# EAGLE design SensadoCalibradoMaquinas_v2 (EAGLE 9.6.2)
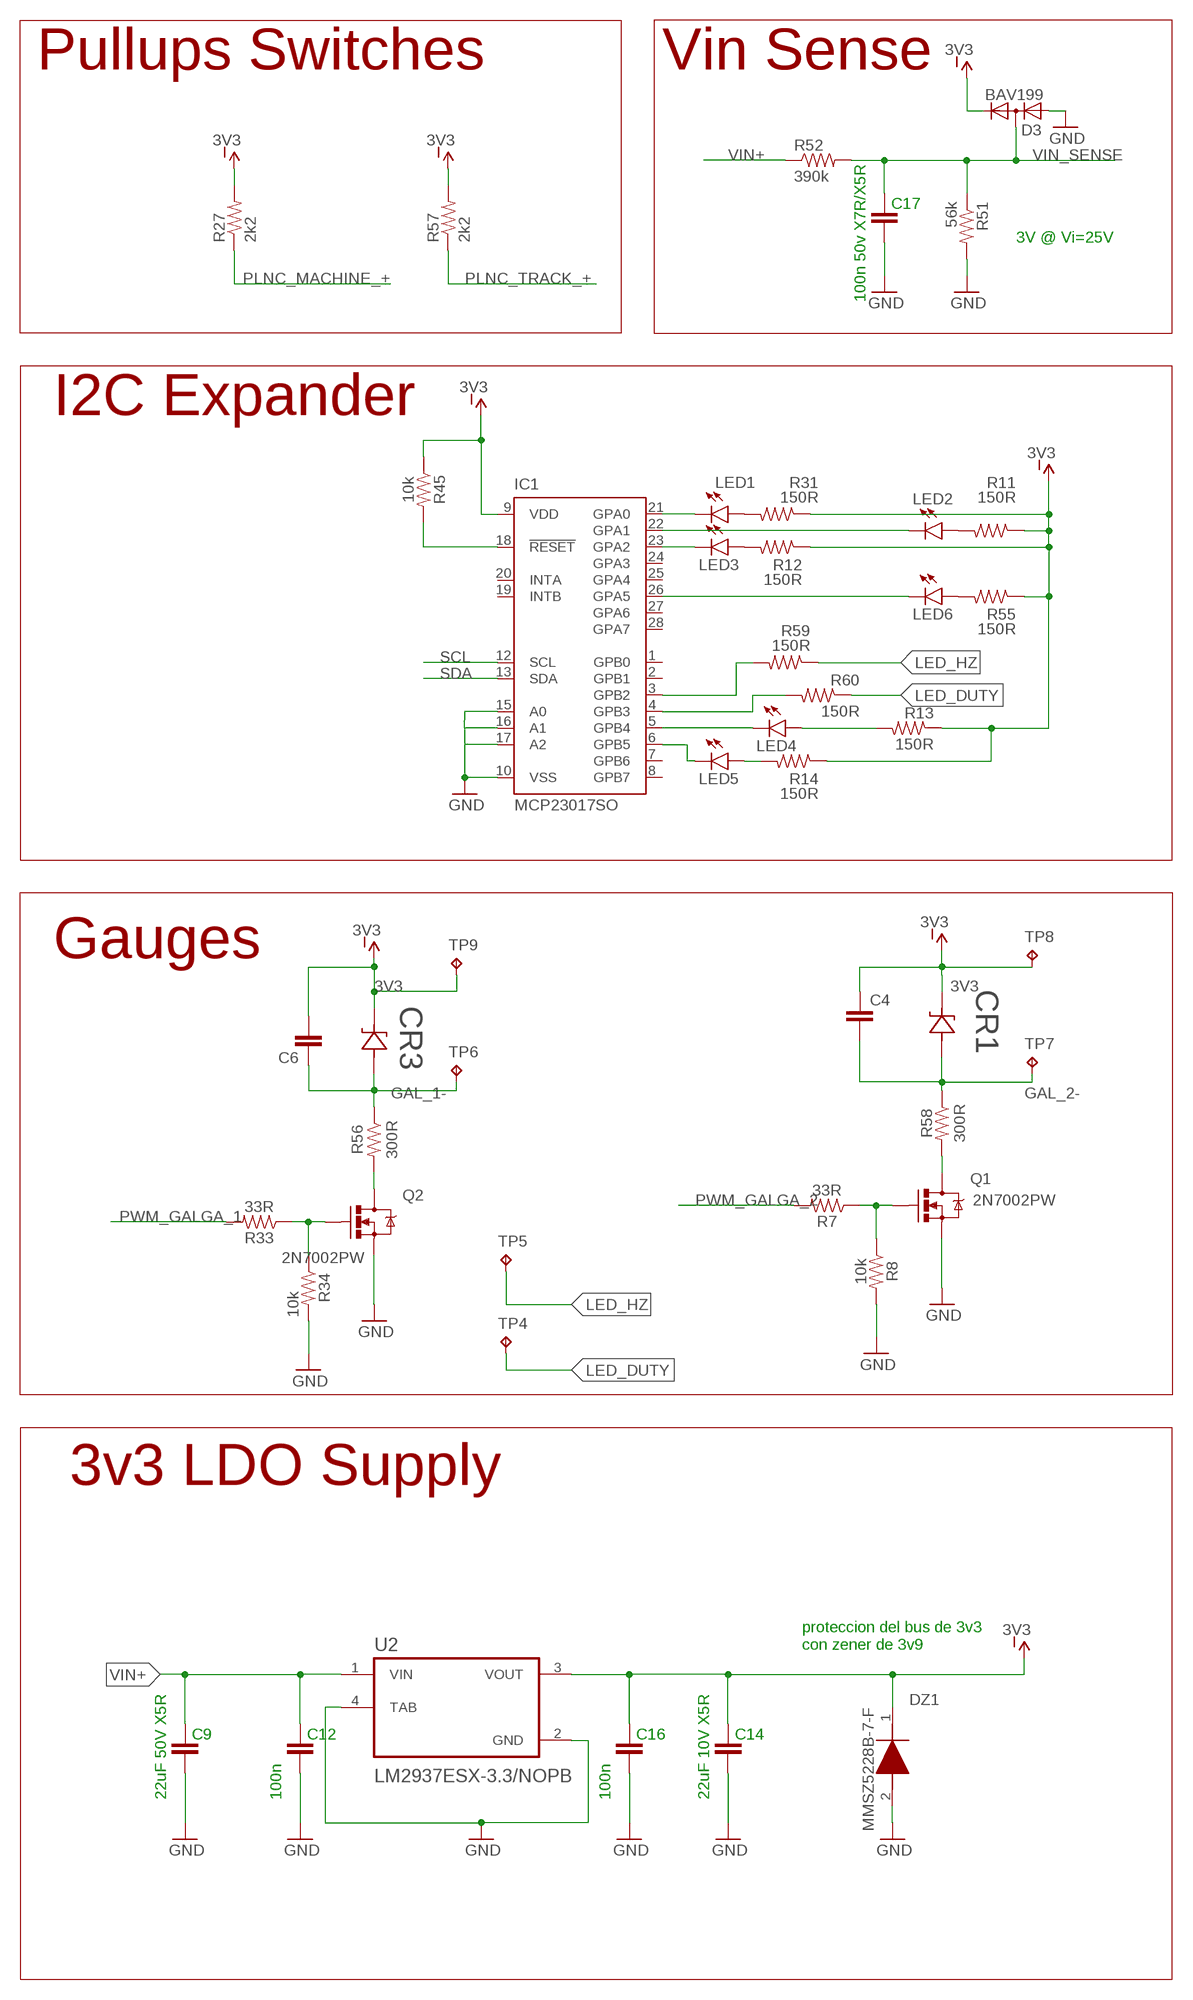
[diagram p0: schematic, sheet 1, part 1 of 2]
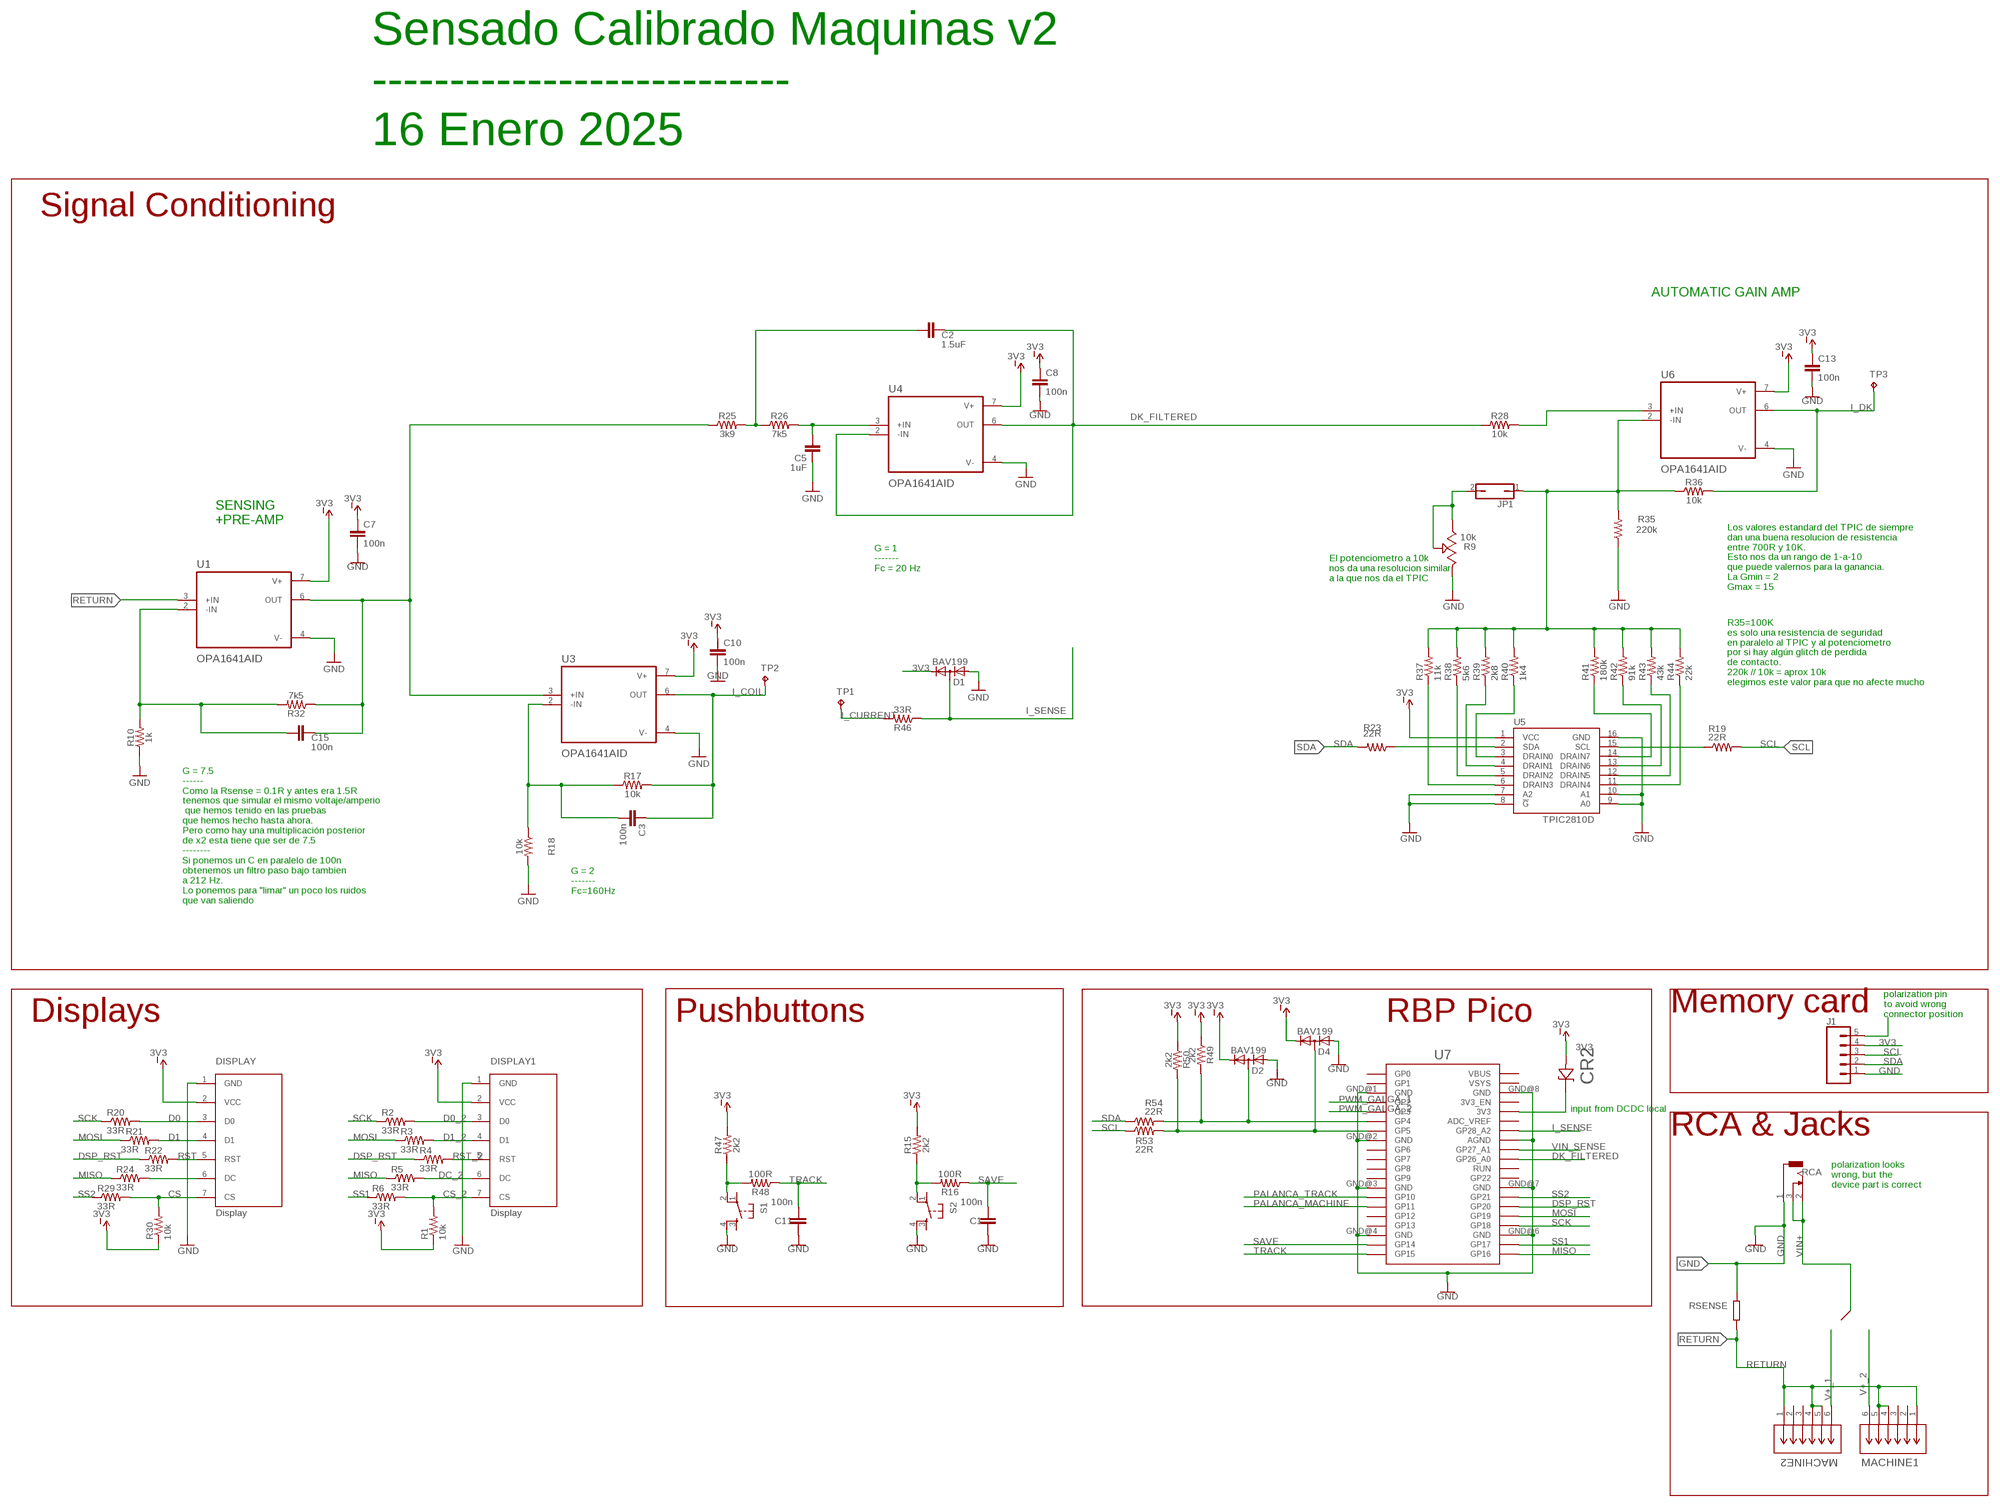
[diagram p1: schematic, sheet 1, part 2 of 2]

## Parts
C1  100n  1.0UF-0805-25V-(+80/-20%)  [0805]
C2  1.5uF  CAP0805  [0805]
C3  100n  CAP0805  [0805]
C4  CAP0805  [0805]
C5  1uF  CAP0805  [0805]
C6  CAP0805  [0805]
C7  100n  1.0UF-0805-25V-(+80/-20%)  [0805]
C8  100n  1.0UF-0805-25V-(+80/-20%)  [0805]
C9  22uF 50V X5R  CAP0805  [0805]
C10  100n  1.0UF-0805-25V-(+80/-20%)  [0805]
C11  100n  1.0UF-0805-25V-(+80/-20%)  [0805]
C12  100n  CAP0805  [0805]
C13  100n  1.0UF-0805-25V-(+80/-20%)  [0805]
C14  22uF 10V X5R  CAP0805  [0805]
C15  100n  CAP0805  [0805]
C16  100n  CAP0805  [0805]
C17  100n 50v X7R/X5R  CAP0805  [0805]
CR1  STPS1L40U  [SMB_STM]
CR2  STPS1L40U  [SMB_STM]
CR3  STPS1L40U  [SMB_STM]
D1  BAV199  [SOT23]
D2  BAV199  [SOT23]
D3  BAV199  [SOT23]
D4  BAV199  [SOT23]
DISPLAY  Display  OLED_LCD  [OLED_LCD]
DISPLAY1  Display  OLED_LCD  [OLED_LCD]
DZ1  MMSZ5228B-7-F  [SODFL3518X115N]
IC1  MCP23017SO  [SO28W]
J1  CONN_05  [1X05]
JP1  JP1Q  [JP1]
LED1  LED3MM  [LED3MM]
LED2  LED3MM  [LED3MM]
LED3  LED3MM  [LED3MM]
LED4  LED3MM  [LED3MM]
LED5  LED3MM  [LED3MM]
LED6  LED3MM  [LED3MM]
MACHINE1  ACJS-MHDR  [CONN_MHDR_AMP]
MACHINE2  ACJS-MHDR  [CONN_MHDR_AMP]
Q1  2N7002PW  MOSFET-NCHANNEL2N7002PW  [SOT323]
Q2  2N7002PW  MOSFET-NCHANNEL2N7002PW  [SOT323]
R1  10k  RESISTOR0805  [0805]
R2  33R  RESISTOR0805  [0805]
R3  33R  RESISTOR0805  [0805]
R4  33R  RESISTOR0805  [0805]
R5  33R  RESISTOR0805  [0805]
R6  33R  RESISTOR0805  [0805]
R7  33R  RESISTOR0805  [0805]
R8  10k  RESISTOR0805  [0805]
R9  10k  PT01-D120D-B104  [TRIM_PT01-D120D-B104]
R10  1k  RESISTOR0805  [0805]
R11  150R  RESISTOR0805  [0805]
R12  150R  RESISTOR0805  [0805]
R13  150R  RESISTOR0805  [0805]
R14  150R  RESISTOR0805  [0805]
R15  2k2  RESISTOR0805  [0805]
R16  100R  RESISTOR0805  [0805]
R17  10k  RESISTOR0805  [0805]
R18  10k  RESISTOR0805  [0805]
R19  22R  RESISTOR0805  [0805]
R20  33R  RESISTOR0805  [0805]
R21  33R  RESISTOR0805  [0805]
R22  33R  RESISTOR0805  [0805]
R23  22R  RESISTOR0805  [0805]
R24  33R  RESISTOR0805  [0805]
R25  3k9  RESISTOR0805  [0805]
R26  7k5  RESISTOR0805  [0805]
R27  2k2  RESISTOR0805  [0805]
R28  10k  RESISTOR0805  [0805]
R29  33R  RESISTOR0805  [0805]
R30  10k  RESISTOR0805  [0805]
R31  150R  RESISTOR0805  [0805]
R32  7k5  RESISTOR0805  [0805]
R33  33R  RESISTOR0805  [0805]
R34  10k  RESISTOR0805  [0805]
R35  220k  RESISTOR0805  [0805]
R36  10k  RESISTOR0805  [0805]
R37  11k  RESISTOR0805  [0805]
R38  5k6  RESISTOR0805  [0805]
R39  2k8  RESISTOR0805  [0805]
R40  1k4  RESISTOR0805  [0805]
R41  180k  RESISTOR0805  [0805]
R42  91k  RESISTOR0805  [0805]
R43  43k  RESISTOR0805  [0805]
R44  22k  RESISTOR0805  [0805]
R45  10k  RESISTOR0805  [0805]
R46  33R  RESISTOR0805  [0805]
R47  2k2  RESISTOR0805  [0805]
R48  100R  RESISTOR0805  [0805]
R49  2k2  RESISTOR0805  [0805]
R50  2k2  RESISTOR0805  [0805]
R51  56k  RESISTOR0805  [0805]
R52  390k  RESISTOR0805  [0805]
R53  22R  RESISTOR0805  [0805]
R54  22R  RESISTOR0805  [0805]
R55  150R  RESISTOR0805  [0805]
R56  300R  RESISTOR0805  [0805]
R57  2k2  RESISTOR0805  [0805]
R58  300R  RESISTOR0805  [0805]
R59  150R  RESISTOR0805  [0805]
R60  150R  RESISTOR0805  [0805]
RCA  PJRAN1X1U01X  [PJRAN1X1U01X]
RSENSE  0.1R  R_CHIP-2512(6332-METRIC)  [RESC6332X71]
S1  TAC_SWITCH_KSC931G-SMD  [TAC_SW_SMD_KSC931G]
S2  TAC_SWITCH_KSC931G-SMD  [TAC_SW_SMD_KSC931G]
TP1  TPTP06SQ  [TP06SQ]
TP2  TPTP06SQ  [TP06SQ]
TP3  TPTP06SQ  [TP06SQ]
TP4  TPTP06SQ  [TP06SQ]
TP5  TPTP06SQ  [TP06SQ]
TP6  TPTP06SQ  [TP06SQ]
TP7  TPTP06SQ  [TP06SQ]
TP8  TPTP06SQ  [TP06SQ]
TP9  TPTP06SQ  [TP06SQ]
U1  OPA1641AID  [SOIC127P599X175-8N]
U2  LM2937ESX-3.3/NOPB  [TO254P1524X483-4N]
U3  OPA1641AID  [SOIC127P599X175-8N]
U4  OPA1641AID  [SOIC127P599X175-8N]
U5  TPIC2810D  [SO16]
U6  OPA1641AID  [SOIC127P599X175-8N]
U7  RPI_PICO_IG-TH  [RPI_PICO_TH]

## Nets
3V3: C4.1 C6.2 C7.2 C8.2 C10.2 C13.2 C14.2 C16.2 CR1.2 CR2.1 CR3.2 D1.2(C) D2.2(C) D3.2(C) D4.2(C) DISPLAY1.2(VCC) DISPLAY.2(VCC) DZ1.1(K) IC1.9(VDD) J1.4 R1.1 R11.1 R12.1 R13.1 R14.1 R15.2 R27.2 R30.1 R31.1 R45.1 R47.2 R49.1 R50.1 R55.1 R57.2 TP8.TP TP9.TP U1.7(V+) U2.3(VOUT) U3.7(V+) U4.7(V+) U5.1(VCC) U6.7(V+)
CS: DISPLAY.7(CS) R29.2 R30.2
CS_2: DISPLAY1.7(CS) R1.2 R6.2
D0: DISPLAY.3(D0) R20.2
D0_2: DISPLAY1.3(D0) R2.2
D1: DISPLAY.4(D1) R21.2
D1_2: DISPLAY1.4(D1) R3.2
DC_2: DISPLAY1.6(DC) R5.2
DK_FILTERED: C2.1 R28.1 U4.2(-IN) U4.6(OUT) U7.GP26_A0
DSP_RST: R4.1 R22.1 U7.GP20
GAIN: C15.1 R25.1 R32.1 U1.6(OUT) U3.3(+IN)
GAL_1-: C6.1 CR3.1 R56.1 TP6.TP
GAL_2-: C4.2 CR1.1 R58.1 TP7.TP
GND: C1.1 C5.1 C7.1 C8.1 C9.1 C10.1 C11.1 C12.1 C13.1 C14.1 C16.1 C17.1 D1.1(A) D2.1(A) D3.1(A) D4.1(A) DISPLAY1.1(GND) DISPLAY.1(GND) DZ1.2(A) IC1.10(VSS) IC1.15(A0) IC1.16(A1) IC1.17(A2) J1.1 Q1.2(S) Q2.2(S) R8.2 R9.1 R10.1 R18.2 R34.2 R35.1 R51.2 RCA.1 RSENSE.2 S1.4 S2.4 U1.4(V-) U2.2(GND) U2.4(TAB) U3.4(V-) U4.4(V-) U5.7(A2) U5.8(!G) U5.9(A0) U5.10(A1) U5.16(GND) U6.4(V-) U7.AGND U7.GND@1(GND) U7.GND@2(GND) U7.GND@3(GND) U7.GND@4(GND) U7.GND@6(GND) U7.GND@7(GND) U7.GND@8(GND)
I_COIL: C3.1 R17.2 TP2.TP U3.6(OUT)
I_CURRENT: R46.2 TP1.TP
I_DK: R36.2 TP3.TP U6.6(OUT)
I_SENSE: D1.3(AC) R46.1 U7.GP28_A2
LED_DUTY: R60.1 TP4.TP
LED_HZ: R59.1 TP5.TP
MISO: R5.1 R24.1 U7.GP16
MOSI: R3.1 R21.1 U7.GP19
N$1: D2.3(AC) R49.2 R54.2 U7.GP4
N$2: Q2.1(G) R33.1 R34.1
N$3: Q1.1(G) R7.1 R8.1
N$4: C15.2 R10.2 R32.2 U1.2(-IN)
N$5: R28.2 U6.3(+IN)
N$6: LED1.A R31.2
N$7: DISPLAY.6(DC) R24.2
N$8: IC1.22(GPA1) LED2.K(C)
N$9: LED2.A R11.2
N$10: IC1.23(GPA2) LED3.K(C)
N$11: LED4.A R13.2
N$12: IC1.5(GPB4) LED4.K(C)
N$13: LED5.A R14.2
N$14: IC1.6(GPB5) LED5.K(C)
N$15: R15.1 R16.2 S2.2
N$16: JP1.1 R35.2 R36.1 R37.2 R38.2 R39.2 R40.2 R41.2 R42.2 R43.2 R44.2 U6.2(-IN)
N$17: R37.1 U5.6(DRAIN3)
N$18: R38.1 U5.5(DRAIN2)
N$19: R39.1 U5.4(DRAIN1)
N$20: R40.1 U5.3(DRAIN0)
N$21: R41.1 U5.14(DRAIN7)
N$22: R42.1 U5.13(DRAIN6)
N$23: R43.1 U5.12(DRAIN5)
N$24: R44.1 U5.11(DRAIN4)
N$25: IC1.3(GPB2) R59.2
N$26: R19.1 U5.15(SCL)
N$27: IC1.4(GPB3) R60.2
N$28: LED6.A R55.2
N$29: CR2.2 U7.3V3
N$30: C2.2 R25.2 R26.1
N$31: C5.2 R26.2 U4.3(+IN)
N$34: C3.2 R17.1 R18.1 U3.2(-IN)
N$36: D4.3(AC) R50.2 R53.2 U7.GP5
N$37: IC1.26(GPA5) LED6.K(C)
N$38: R47.1 R48.2 S1.2
N$39: J1.5
N$40: R23.1 U5.2(SDA)
N$41: Q2.3(D) R56.2
N$42: LED3.A R12.2
N$44: Q1.3(D) R58.2
N$45: IC1.18(!RESET) R45.2
N$46: JP1.2 R9.2 R9.3
N$59: IC1.21(GPA0) LED1.K(C)
PALANCA_MACHINE: U7.GP11
PALANCA_TRACK: U7.GP10
PLNC_MACHINE_+: R27.1
PLNC_TRACK_+: R57.1
PWM_GALGA_1: R33.2 U7.GP2
PWM_GALGA_2: R7.2 U7.GP3
RETURN: MACHINE1.1 MACHINE1.4 MACHINE1.5 MACHINE2.1 MACHINE2.4 MACHINE2.5 RSENSE.1 U1.3(+IN)
RST: DISPLAY.5(RST) R22.2
RST_2: DISPLAY1.5(RST) R4.2
SAVE: C1.2 R16.1 U7.GP14
SCK: R2.1 R20.1 U7.GP18
SCL: IC1.12(SCL) J1.3 R19.2 R53.1
SDA: IC1.13(SDA) J1.2 R23.2 R54.1
SS1: R6.1 U7.GP17
SS2: R29.1 U7.GP21
TRACK: C11.2 R48.1 U7.GP15
V+_1: MACHINE2.6
V+_2: MACHINE1.6
VIN+: C9.2 C12.2 R52.1 RCA.2 RCA.3 U2.1(VIN)
VIN_SENSE: C17.2 D3.3(AC) R51.1 R52.2 U7.GP27_A1
Unconnected: IC1.1(GPB0) IC1.2(GPB1) IC1.7(GPB6) IC1.8(GPB7) IC1.19(INTB) IC1.20(INTA) IC1.24(GPA3) IC1.25(GPA4) IC1.27(GPA6) IC1.28(GPA7) MACHINE1.2 MACHINE1.3 MACHINE2.2 MACHINE2.3 S1.1 S1.3 S2.1 S2.3 U7.3V3_EN U7.ADC_VREF U7.GP0 U7.GP1 U7.GP6 U7.GP7 U7.GP8 U7.GP9 U7.GP12 U7.GP13 U7.GP22 U7.RUN U7.VBUS U7.VSYS

## Notes on the sheet
- Sensado Calibrado Maquinas v2
  ---------------------------
  16 Enero 2025
- Pullups Switches | Vin Sense | Signal Conditioning
- AUTOMATIC GAIN AMP
- 3V @ Vi=25V
- I2C Expander
- SENSING
  +PRE-AMP
- G = 1
  -------
  Fc = 20 Hz
- El potenciometro a 10k
  nos da una resolucion similar
  a la que nos da el TPIC
- Los valores estandard del TPIC de siempre
  dan una buena resolucion de resistencia
  entre 700R y 10K.
  Esto nos da un rango de 1-a-10
  que puede valernos para la ganancia.
  La Gmin = 2
  Gmax = 15
- R35=100K
  es solo una resistencia de seguridad
  en paralelo al TPIC y al potenciometro
  por si hay algún glitch de perdida
  de contacto.
  220k // 10k = aprox 10k
  elegimos este valor para que no afecte mucho
- Gauges
- G = 2
  -------
  Fc=160Hz
- G = 7.5
  ------
  Como la Rsense = 0.1R y antes era 1.5R
  tenemos que simular el mismo voltaje/amperio
   que hemos tenido en las pruebas 
  que hemos hecho hasta ahora.
  Pero como hay una multiplicación posterior
  de x2 esta tiene que ser de 7.5
  --------
  Si ponemos un C en paralelo de 100n
  obtenemos un filtro paso bajo tambien
  a 212 Hz.
  Lo ponemos para "limar" un poco los ruidos
  que van saliendo
- Memory card
- polarization pin
  to avoid wrong
  connector position
- 3v3 LDO Supply | Displays | Pushbuttons | RBP Pico
- input from DCDC local
- proteccion del bus de 3v3
  con zener de 3v9
- RCA & Jacks
- polarization looks
  wrong, but the 
  device part is correct

## Library data of the parts
C1 C7 C8 C10 C11 C13 = SparkFun-Capacitors:1.0UF: 1µF ceramic capacitors A capacitor is a passive two-terminal electrical component used to store electrical energy temporarily in an electric field.; PROD_ID: CAP-11625; VALUE: 1.0uF
C2-C6 C9 C12 C14-C17 = SparkFun-Passives:CAP: Capacitor Standard 0603 ceramic capacitor, and 0.1" leaded capacitor.
CR1-CR3 = STPS1L40U:STPS1L40U; COPYRIGHT: Copyright (C) 2024 Ultra Librarian. All rights reserved.; MANUFACTURER_PART_NUMBER: STPS1L40U; MFR_NAME: STMicroelectronics
D1-D4 = diode:BAV199: DIODE low-leakage double diode
DISPLAY DISPLAY1 = EDCPSU:OLED_LCD
DZ1 = MMSZ5228B-7-F:MMSZ5228B-7-F: Diodes Inc MMSZ5228B-7-F Zener Diode, 3.9V 5% 500 mW SMT 2-Pin SOD-123 Source: Datasheet <http://au.rs-online.com/web/p/products/8231502P>; DESCRIPTION: Diodes Inc MMSZ5228B-7-F Zener Diode, 3.9V 5% 500 mW SMT 2-Pin SOD-123; HEIGHT: 1.15mm; MANUFACTURER_NAME: Diodes Inc.; MANUFACTURER_PART_NUMBER: MMSZ5228B-7-F
IC1 = adafruit:MCP23017: http://ww1.microchip.com/downloads/en/DeviceDoc/21952a.pdf Source: http://ww1.microchip.com/downloads/en/DeviceDoc/21952a.pdf
J1 = SparkFun-Connectors:CONN_05: Multi connection point. Often used as Generic Header-pin footprint for 0.1 inch spaced/style header connections On any of the 0.1 inch spaced packages, you can populate with these: Break Away Headers - Straight <https://www.sparkfun.com/products/116> (PRT-00116) Break Away Male Headers - Right Angle <https://www.sparkfun.com/products/553> (PRT-00553) Female Headers <https://www.sparkfun.com/products/115> (PRT-00115) Break Away Headers - Machine Pin <https://www.sparkfun.com/products/117> (PRT-00117) Break Away Female Headers - Swiss Machine Pin <https://www.sparkfun.com/products/743> (PRT-00743) For SCREWTERMINALS and SPRING TERMINALS visit here: Screw Terimnals on SparkFun.com <https://www.sparkfun.com/search/results?term=Screw+Terminals> (5mm/3.5mm/2.54mm spacing) This device is also useful as a general connection point to wire up your design to another part of your project. Our various solder wires solder well into these plated through hole pads. Hook-Up Wire - Assortment (Stranded, 22 AWG) <https://www.sparkfun.com/products/11375> (PRT-11375) Hook-Up Wire - Assortment (Solid Core, 22 AWG) <https://www.sparkfun.com/products/11367> (PRT-11367) View the entire wire category on our website here <https://www.sparkfun.com/categories/141> Special notes: Molex polarized connector foot print use with SKU : PRT-08231 with associated crimp pins and housings. 1MM SMD Version SKU: PRT-10208
JP1 = jumper:JP1Q: JUMPER
LED1-LED6 = SparkFun-LED:LED: LEDs Standard schematic elements and footprints for 5mm, 3mm, 1206, and 0603 sized LEDs. 5mm - Spark Fun Electronics SKU : COM-00529 (and others)
MACHINE1 MACHINE2 = ACJSMHDR:ACJS-MHDR; BUILT_BY: EMA_Matt; COPYRIGHT: Copyright (C) 2018 Accelerated Designs. All rights reserved; MANUFACTURER_PART_NUMBER: ACJS-MHDR; SOURCELIBRARY: Amphenol_2019-10-30; VENDOR: Amphenol
Q1 Q2 = SparkFun-DiscreteSemi:MOSFET-NCHANNEL: Common NMOSFET Parts MFG P/N Store ID Prod ID FDD8780 TRANS-09984 SI7820DN TRANS-11055 FDS6630A IC-08089 2N7002PW TRANS-11151 FQP30N06L COM-10213 TRANS-10060 BSS123LT1G TRANS-08345 BSS138 TRANS-00830 BS170 2N7000; PROD_ID: TRANS-11151
R1-R8 R10-R60 = SparkFun-Resistors:RESISTOR: Generic Resistor Package
R9 = PT01-D120D-B104:PT01-D120D-B104; MANUFACTURER: CUI Devices; MAXIMUM_PACKAGE_HEIGHT: 26.8 mm; PARTREV: 1.0; STANDARD: Manufacturer Recommendations
RCA = Connectors:PJRAN1X1U01X: CONN RCA JACK MONO 3.2MM R/A Manufacturer's datasheet <http://www.switchcraft.com/Drawings/pjran1x1u__x_series_cd.pdf>; CREATED_BY: PCBLayout.com; DIGIKEY_PART_NUMBER: PJRAN1X1U01X-ND; MANUFACTURER: Switchcraft Inc.; MPN: PJRAN1X1U01X
RSENSE = Resistor:R: Resistor Fixed - Generic; CATEGORY: Resistor; SUB-CATEGORY: Fixed
S1 S2 = EDCPSU - Rev2:TAC_SWITCH: Momentary Switch Button commonly used for reset or general input. Spark Fun Electronics SKU : COM-00097 SMT- SWCH-08247
TP1-TP9 = testpad:TP: Test pad
U1 U3 U4 U6 = OPA1641AID:OPA1641AID
U2 = LM2937ESX-3.3_NOPB:LM2937ESX-3.3/NOPB
U5 = EDCPSU - Rev2:TPIC2810D
U7 = RaspberryPi_Pico:RPI_PICO_IG

## Board
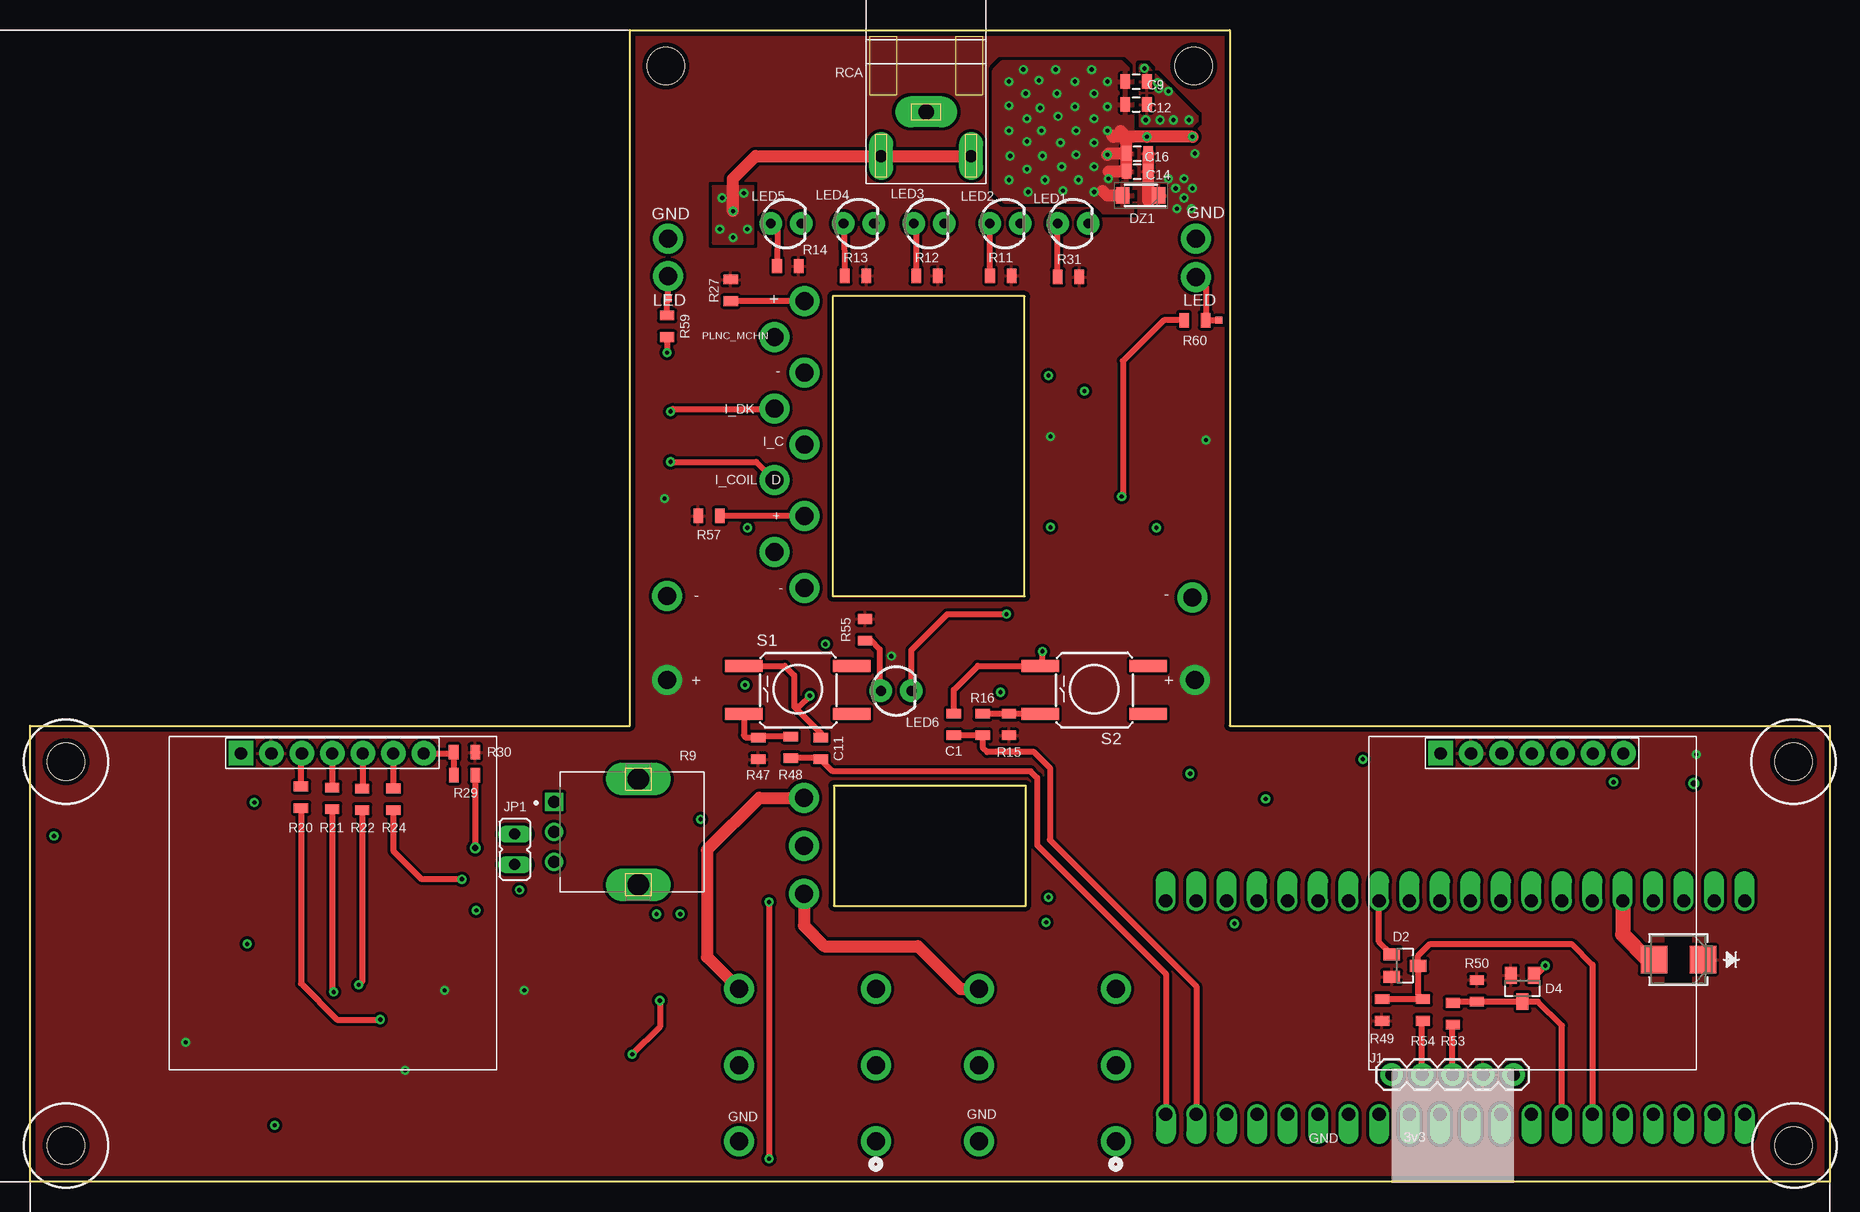
[diagram p2: board, top side]
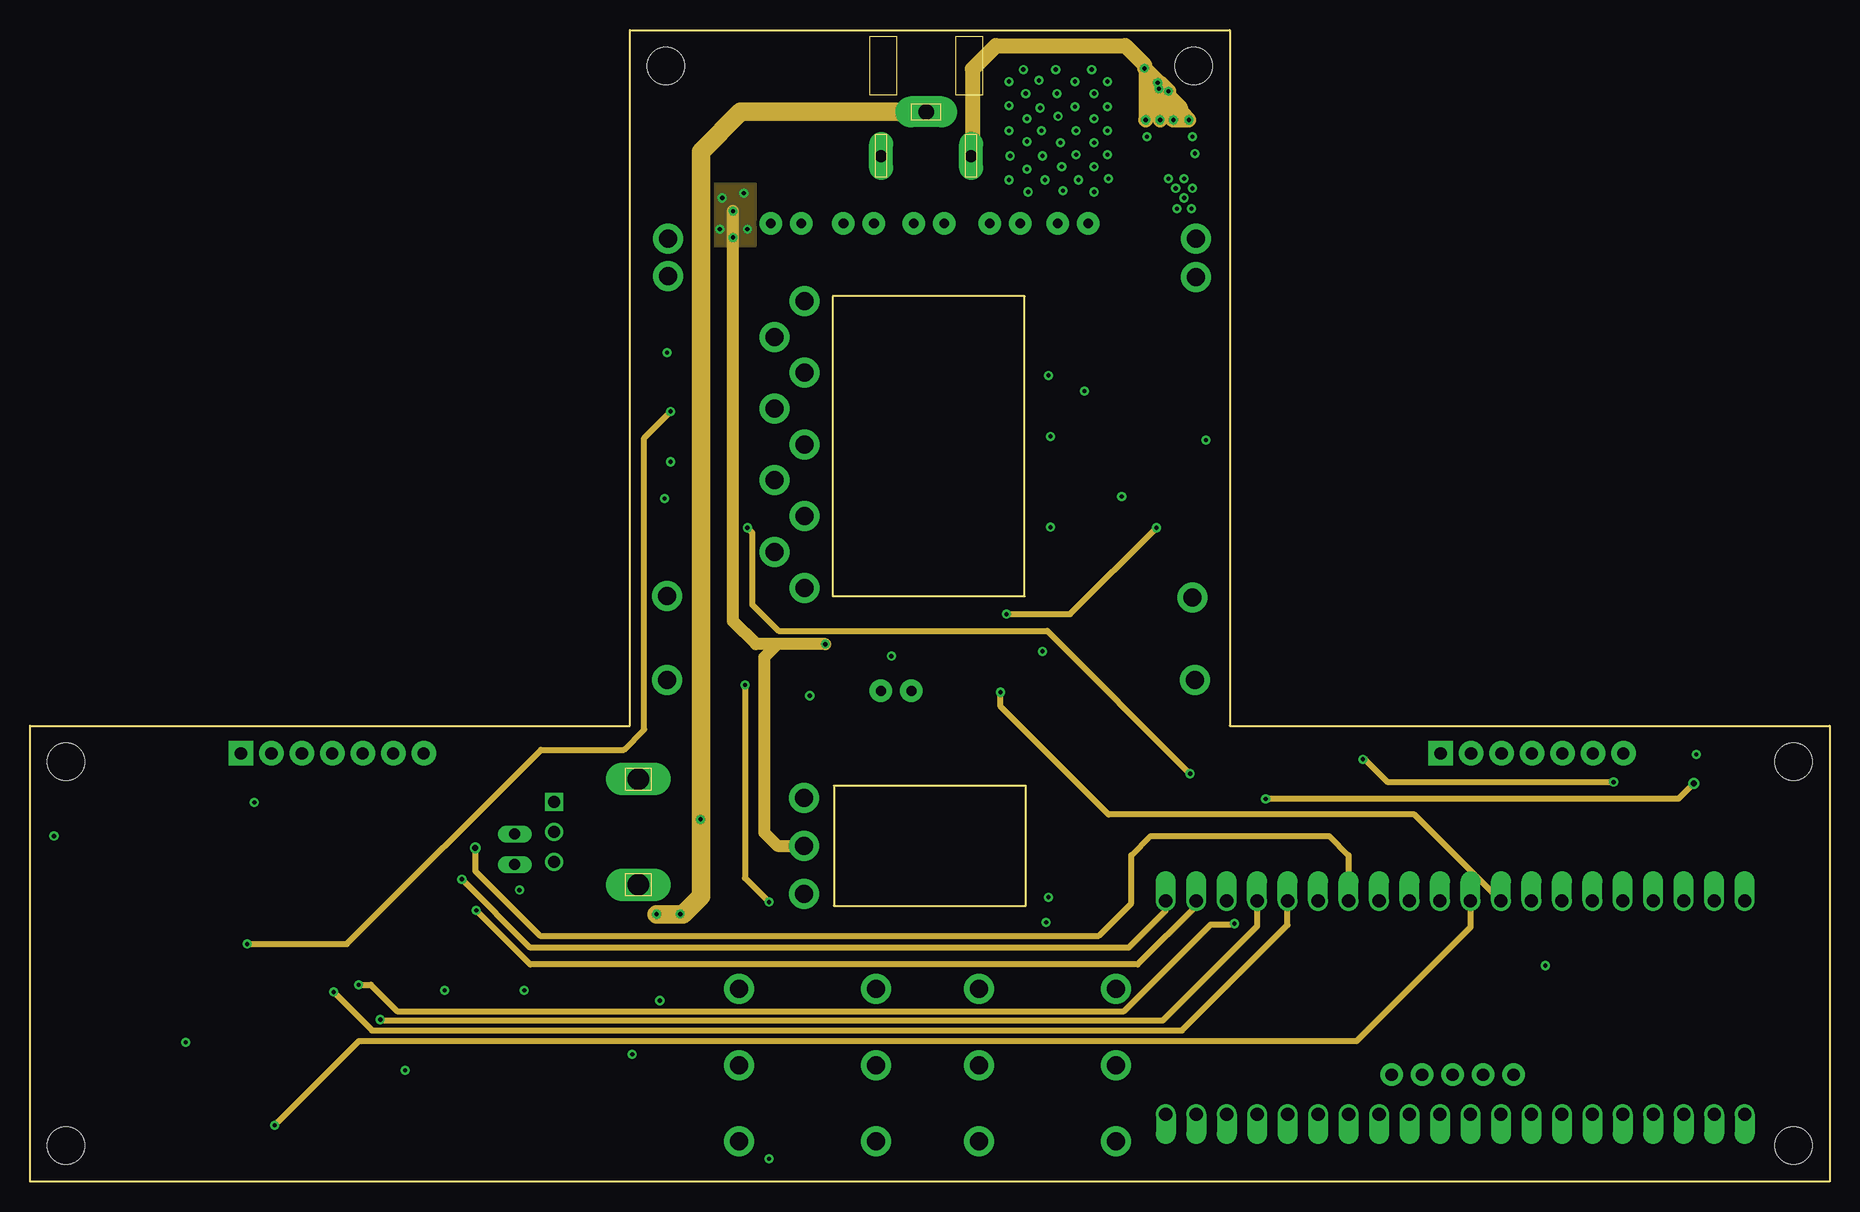
[diagram p3: board, inner layer Route2]
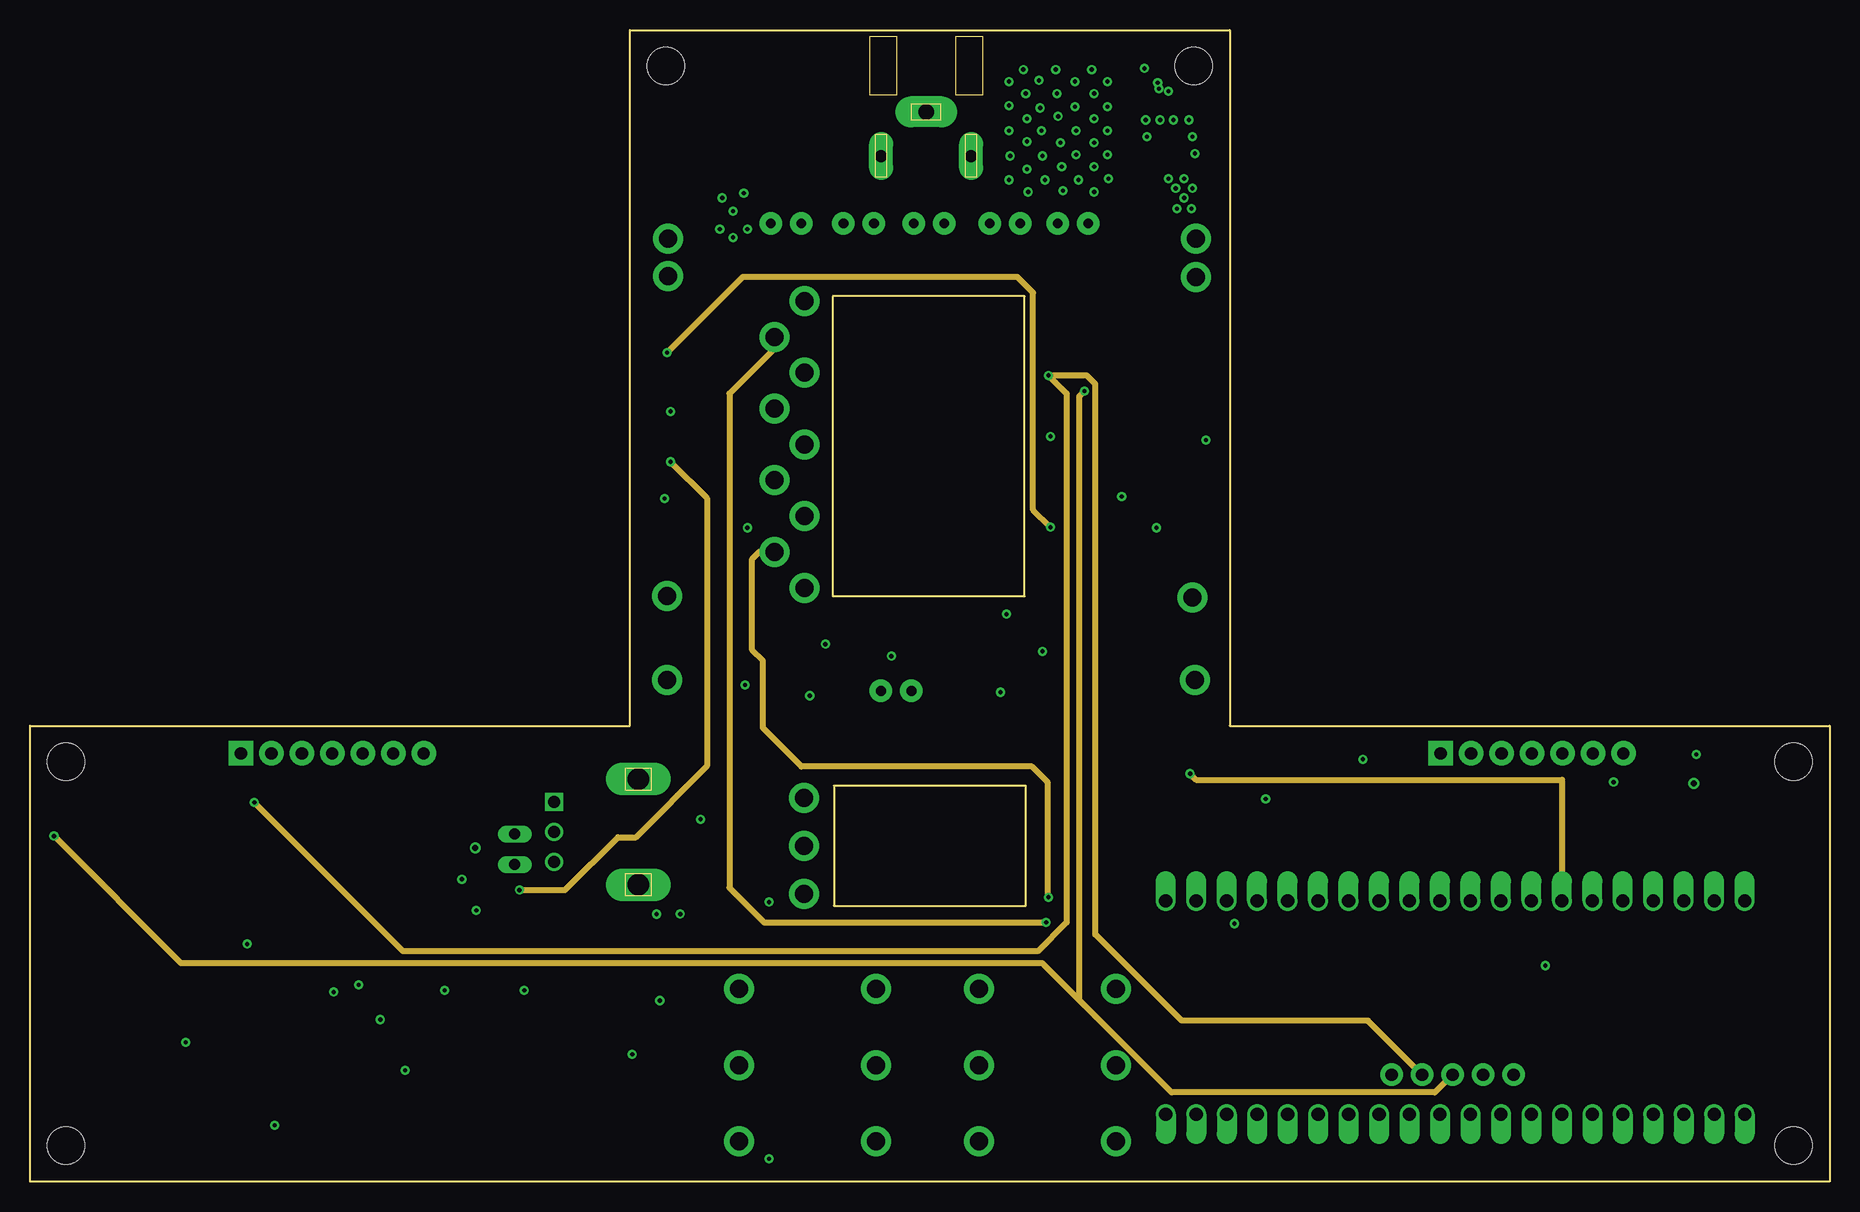
[diagram p4: board, inner layer Route15]
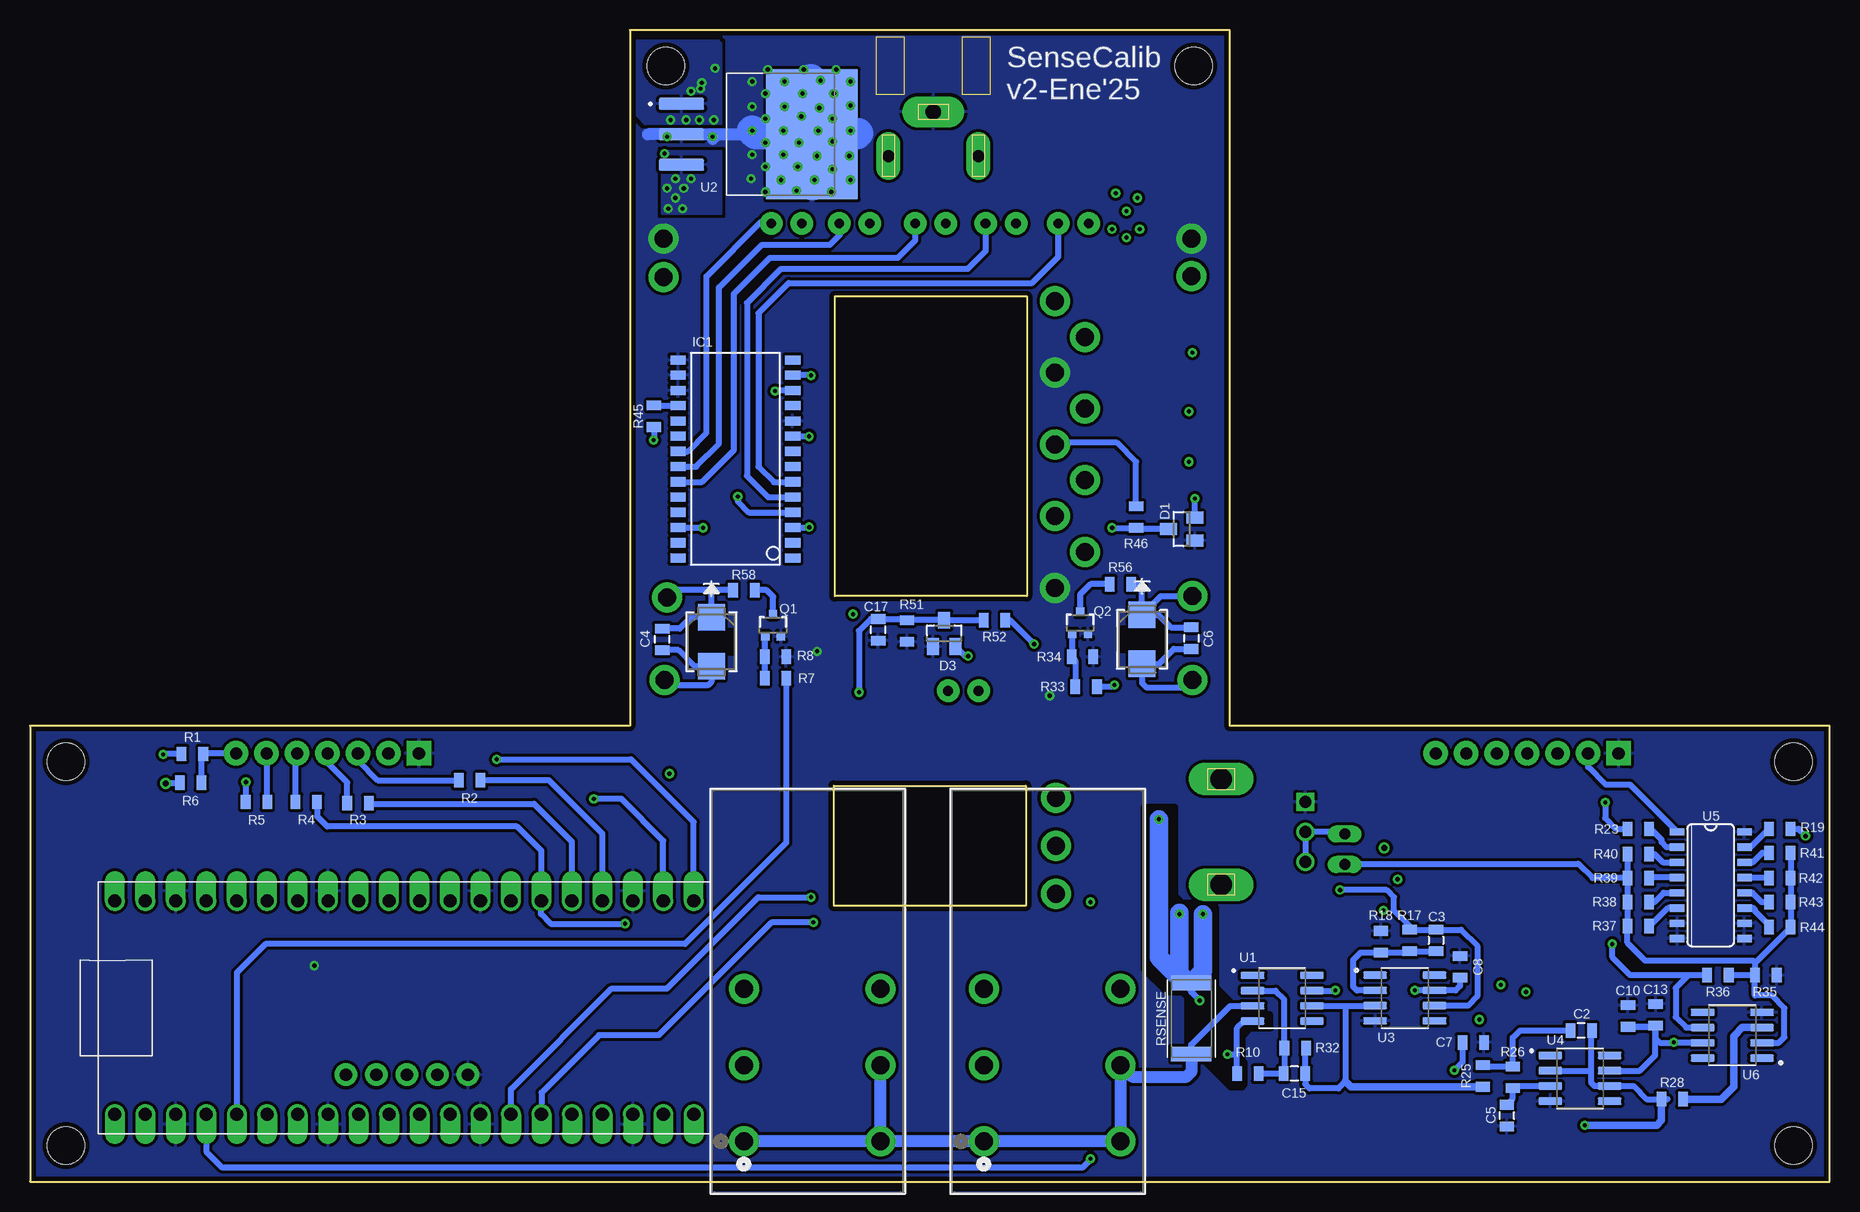
[diagram p5: board, bottom side, seen from below]

Size 150 x 96 mm. Coordinates in mm from the lower left corner, seen from the top.
Outline: 150,0 0,0 0,38 50,38 50,96 100,96 100,38 150,38 150,0
Outline: 82.9,48.8 82.9,73.8 66.9,73.8 66.9,48.8 82.9,48.8
Outline: 83,33 67,33 67,23 83,23 83,33
Copper layers (1+2*15+16): Top 0.035mm / dielectric 1.5mm / Route2 0.035mm / dielectric 0.15mm / Route15 0.035mm / dielectric 0.2mm / Bottom 0.035mm
Design rules "default *": minimum track width 6mil, minimum drill 0.35mm, track to track 10mil, track to pad 10mil, pad to pad 10mil, via to via 10mil, smd to smd 6mil, copper to edge 15mil, drill to drill 6mil, minimum pad ring 10mil, minimum via ring 8mil, stop-mask expansion 4mil, vias tented up to drill 0mil, thermal gap 10mil
Holes 3.1 mm at 147,35.01 147,3 3,3 3,35.01 53.01,93 97,93
bRestrict: area 46.6,7.9 to 57.1,31.2

### Footprints (pad centres in the part's own frame; a part is rotated, then mirrored left to right if it is on the bottom)
0805 = smd 0.8 x 1.2: 1 -0.9,0; 2 0.9,0
SMB_STM = smd 2.21 x 2.261: 1 -2.045,0; 2 2.045,0
SOT23 = smd 1 x 1.4: 1 -0.95,-1.1; 2 0.95,-1.1; 3 0,1.1
OLED_LCD = drill 1.016 pad 2.032 square: 1 -7.42,13.7 | drill 1.016 pad 2.032: 2 -4.88,13.7; 3 -2.34,13.7; 4 0.2,13.7; 5 2.74,13.7; 6 5.28,13.7; 7 7.82,13.7
SODFL3518X115N = smd 1.12 x 1.37: 1 -1.5,0; 2 1.5,0
SO28W = smd 0.762 x 1.27: 1 -7.62,-4.78; 2 -6.35,-4.78; 3 -5.08,-4.78; 4 -3.81,-4.78; 5 -2.54,-4.78; 6 -1.27,-4.78; 7 0,-4.78; 8 1.27,-4.78; 9 2.54,-4.78; 10 3.81,-4.78; 11 5.08,-4.78; 12 6.35,-4.78; 13 7.62,-4.78; 14 8.89,-4.78; 15 8.89,4.78; 16 7.62,4.78; 17 6.35,4.78; 18 5.08,4.78; 19 3.81,4.78; 20 2.54,4.78; 21 1.27,4.78; 22 0,4.78; 23 -1.27,4.78; 24 -2.54,4.78; 25 -3.81,4.78; 26 -5.08,4.78; 27 -6.35,4.78; 28 -7.62,4.78
1X05 = drill 1.016 pad 1.88: 1 0,0; 2 2.54,0; 3 5.08,0; 4 7.62,0; 5 10.16,0
JP1 = drill 0.914 long: 1 0,-1.27; 2 0,1.27
LED3MM = drill 0.813 pad 1.88: A -1.27,0; K 1.27,0
CONN_MHDR_AMP = drill 1.5 pad 2.5: 1 0,0; 2 -6.35,0; 3 -12.7,0; 4 0,11.405; 5 -6.35,11.405; 6 -12.7,11.405
SOT323 = smd 0.7 x 0.7: 1 -0.65,-0.925; 2 0.65,-0.925; 3 0,0.925
TRIM_PT01-D120D-B104 = drill 1 square: 1 -2.5,-7 | drill 1: 2 0,-7; 3 2.5,-7 | drill 1.8 pad 2.3 long: S1 -4.4,0; S2 4.4,0
PJRAN1X1U01X = drill 1.3 pad 2.6 long: 1 0,0 | drill 1 pad 2 long: 2 3.75,3.7; 3 -3.75,3.7
RESC6332X71 = smd 1.231 x 3.37: 1 -2.97,0; 2 2.97,0
TAC_SW_SMD_KSC931G = smd 3.1 x 1: 1 -4.5,2; 2 4.5,2; 3 -4.5,-2; 4 4.5,-2
TP06SQ = smd 0.6 x 0.6: TP 0,0
SOIC127P599X175-8N = smd 1.97 x 0.6: 1 -2.47,1.905; 2 -2.47,0.635; 3 -2.47,-0.635; 4 -2.47,-1.905; 5 2.47,-1.905; 6 2.47,-0.635; 7 2.47,0.635; 8 2.47,1.905
TO254P1524X483-4N = smd 3.79 x 0.99: 1 -6.4,2.54; 2 -6.4,0; 3 -6.4,-2.54 | smd 7.62 x 10.84: 4 4.48,0
SO16 = smd 0.6 x 1.2: 1 -4.445,-2.8; 2 -3.175,-2.8; 3 -1.905,-2.8; 4 -0.635,-2.8; 5 0.635,-2.8; 6 1.905,-2.8; 7 3.175,-2.8; 8 4.445,-2.8; 9 4.445,2.8; 10 3.175,2.8; 11 1.905,2.8; 12 0.635,2.8; 13 -0.635,2.8; 14 -1.905,2.8; 15 -3.175,2.8; 16 -4.445,2.8
RPI_PICO_TH = drill 1.1 pad 1.6 offset: 3V3 8.89,13.97; 3V3_EN 8.89,16.51; ADC_VREF 8.89,11.43; AGND 8.89,6.35; GND@1 -8.89,19.05; GND@2 -8.89,6.35; GND@3 -8.89,-6.35; GND@4 -8.89,-19.05; GND@6 8.89,-19.05; GND@7 8.89,-6.35; GND@8 8.89,19.05; GP0 -8.89,24.13; GP1 -8.89,21.59; GP2 -8.89,16.51; GP3 -8.89,13.97; GP4 -8.89,11.43; GP5 -8.89,8.89; GP6 -8.89,3.81; GP7 -8.89,1.27; GP8 -8.89,-1.27; GP9 -8.89,-3.81; GP10 -8.89,-8.89; GP11 -8.89,-11.43; GP12 -8.89,-13.97; GP13 -8.89,-16.51; GP14 -8.89,-21.59; GP15 -8.89,-24.13; GP16 8.89,-24.13; GP17 8.89,-21.59; GP18 8.89,-16.51; GP19 8.89,-13.97; GP20 8.89,-11.43; GP21 8.89,-8.89; GP22 8.89,-3.81; GP26_A0 8.89,1.27; GP27_A1 8.89,3.81; GP28_A2 8.89,8.89; RUN 8.89,-1.27; VBUS 8.89,24.13; VSYS 8.89,21.59

### Placement (x,y rotation side)
C1  77,38.1 270 top
C2  20.7,12.6 180 bottom
C3  32.8,20.1 270 bottom
C4  97.3,45.2 90 bottom
C5  26.9,5.5 90 bottom
C6  53.2,45.3 270 bottom
C7  29.7,11.6 180 bottom
C8  30.8,17.9 270 bottom
C9  92.2,91.7 0 top
C10  16.8,13.8 270 bottom
C11  65.9,36.1 270 top
C12  92.2,89.79 0 top
C13  14.5,13.9 270 bottom
C14  92.3,84.2 0 top
C15  44.6,9 180 bottom
C16  92.3,85.7 0 top
C17  79.3,46 90 bottom
CR1  93.2,45 270 bottom
CR2  137.4,18.5 180 top
CR3  57.3,45.2 270 bottom
D1  54,54.4 90 bottom
D2  114.6,18 270 top
D3  73.8,45.7 0 bottom
D4  124.4,16.1 180 top
DISPLAY  25,22 0 top
DISPLAY1  125,22 0 top
DZ1  92.6,82.2 180 top
IC1  91.2,59.6 90 bottom
J1  113.5,8.9 0 top
JP1  40.4,27.7 0 top
LED1  86.93,79.87 0 top
LED2  81.28,79.87 0 top
LED3  74.93,79.87 0 top
LED4  69.08,79.87 0 top
LED5  63.03,79.87 0 top
LED6  72.2,40.9 0 top
MACHINE1  90.5,3.35 270 bottom
MACHINE2  70.5,3.35 270 bottom
Q1  88.06,46.37 0 bottom
Q2  62.46,46.57 0 bottom
R1  136.46,35.65 0 bottom
R2  113.35,33.45 180 bottom
R3  122.66,31.55 180 bottom
R4  126.97,31.65 180 bottom
R5  131.12,31.65 0 bottom
R6  136.61,33.25 0 bottom
R7  87.86,41.96 0 bottom
R8  87.86,43.75 0 bottom
R9  50.7,29.15 270 top
R10  48.48,8.99 0 bottom
R11  80.92,75.51 180 top
R12  74.77,75.51 180 top
R13  68.82,75.51 180 top
R14  63.17,76.31 180 top
R15  81.6,38.1 270 top
R16  79.4,38.1 90 top
R17  35,20.1 90 bottom
R18  37.4,20 90 bottom
R19  4.15,29.4 0 bottom
R20  22.59,32.04 90 top
R21  25.19,31.95 90 top
R22  27.69,31.86 90 top
R23  15.95,29.4 180 bottom
R24  30.29,31.87 90 top
R25  28.9,8.8 90 bottom
R26  26.4,8.7 270 bottom
R27  58.4,74.3 90 top
R28  13.11,6.87 0 bottom
R29  36.22,33.89 180 top
R30  36.21,35.79 180 top
R31  86.57,75.41 180 top
R32  44.54,11.14 180 bottom
R33  61.96,41.26 0 bottom
R34  62.26,43.75 0 bottom
R35  5.3,17.2 180 bottom
R36  9.3,17.2 180 bottom
R37  15.95,21.3 180 bottom
R38  15.95,23.3 180 bottom
R39  15.95,25.3 180 bottom
R40  15.95,27.3 180 bottom
R41  4.15,27.4 0 bottom
R42  4.15,25.3 0 bottom
R43  4.15,23.3 0 bottom
R44  4.15,21.2 0 bottom
R45  98,63.8 90 bottom
R46  57.8,55.4 90 bottom
R47  60.7,36.1 270 top
R48  63.4,36.2 90 top
R49  112.7,14.3 90 top
R50  120.6,15.9 270 top
R51  76.9,45.9 270 bottom
R52  69.6,46.8 180 bottom
R53  118.6,14 90 top
R54  116.1,14.3 90 top
R55  69.6,46 270 top
R56  59.1,49.8 180 bottom
R57  56.6,55.5 180 top
R58  90.5,49.3 0 bottom
R59  53.1,71.3 270 top
R60  97.1,71.8 180 top
RCA  74.7,89.18 180 top
RSENSE  53.2,13.6 90 bottom
S1  64,41 180 top
S2  88.7,41 180 top
TP1  64.6,61.4 0 bottom
TP2  62.2,58.4 0 top
TP3  62,64.4 0 top
TP4  99.1,71.8 0 top
TP5  53.2,73.6 0 top
TP6  53.1,48.7 0 top
TP7  96.8,48.7 0 top
TP8  53.1,41.8 0 top
TP9  97.1,41.8 0 top
U1  45.62,15.28 0 bottom
U2  89.3,87.3 0 bottom
U3  35.4,15.3 0 bottom
U4  20.8,8.6 0 bottom
U5  9.9,24.7 270 bottom
U6  8.1,12.2 180 bottom
U7  118.8,14.5 90 bottom

### Tracks (layer width: path | path; a pad name or v marks a point on that pad's centre or on a via)
3V3  (via drill 0.35, 1.5 pad 2.5)
  Top 1.016: 93.3,81.7 93.2,81.8 C14.2 C16.2
  Bottom 0.508: U5.1 16.62,33.07 18.63,33.07 20.12,34.56 DISPLAY.2 | U6.7 12.96,11.57 | 12.96,11.57 v12.99,11.6 | U1.7 41.23,15.91 v41.2,15.94 | v34.57,15.94 v34.56,15.93 U3.7 31.16,15.93 30.8,16.3 C8.2 | U4.7 15.8,9.23 14.56,10.48 14.56,12.9 C10.2 14.6,12.9 C13.2 14.5,11.9 14.16,11.57 12.96,11.57 | D1.2 v52.9,56.93 v52.89,56.94 | IC1.9 85.09,62.14 v85.07,62.12 | R45.1 v98,61.83 v98.01,61.82 | C6.2 54.66,44.4 55.91,43.16 CR3.2 57.3,41.55 56.94,41.19 53.71,41.19 TP8.TP | C4.1 95.94,44.3 94.59,42.95 CR1.2 93.2,41.66 93.5,41.36 96.66,41.36 TP9.TP | D3.2 72.05,43.8 v71.8,43.8 | R1.1 138.85,35.65 v138.9,35.6 | C7.2 30.6,9.94 v31.27,9.27
  other vias: 53.1,41.8 97.1,41.8 94.9,83.6 95.6,81.1 96.2,82 96.2,83.6 96.9,82.8 96.8,81.1 95.5,82.8 97.1,85.7
  pour Top (isolate 0.254, rank 2): -4.6,-4.17 153.1,-4.17 153.1,101.5 -4.6,101.5
  pour Top: 92.8,85.8 97.3,85.8 97.3,81.4 96.6,80.7 93.3,80.7 92.8,81.2
  pour Bottom: 92.4,85.9 97.3,85.9 97.3,80.7 92.4,80.7
CS
  Top 0.508: DISPLAY.7 35.22,35.7 R30.2 R29.2
CS_2
  Bottom 0.508: DISPLAY1.7 135.51,35.7 R1.2 135.71,35.5 R6.2
D0
  Top 0.508: R20.2 22.59,35.63 DISPLAY.3
D0_2
  Bottom 0.508: DISPLAY1.3 122.66,35.1 121.01,33.45 R2.2
D1
  Top 0.508: DISPLAY.4 R21.2
D1_2
  Bottom 0.508: R3.2 123.56,33.26 125.2,34.9 DISPLAY1.4
DC_2
  Bottom 0.508: R5.2 130.22,35.64 DISPLAY1.6
DK_FILTERED  (via drill 0.35)
  Route2 0.508: v20.4,4.7 27.4,11.7 110.58,11.7 120.07,21.19 U7.GP26_A0
  Bottom 0.508: C2.1 19.89,12.51 19.89,9.35 | 19.89,9.35 19.89,8.27 19.59,7.96 U4.6 16.33,7.96 15.23,6.86 13.49,6.86 R28.1 | U4.2 20,9.23 19.89,9.35
  Bottom 0.61: v20.4,4.7 14.4,4.7 14.01,5.09 R28.1
DSP_RST  (via drill 0.35)
  Top 0.508: R22.1 27.69,16.69 v27.4,16.4
  Route2 0.508: v27.4,16.4 28.4,16.4 30.6,14.2 91.2,14.2 98.4,21.4 100.3,21.4 v100.4,21.5
  Bottom 0.508: R4.1 126.07,30.45 125.22,29.6 109.4,29.6 107.37,27.57 U7.GP20 107.4,23.36 107.4,22.3 106.6,21.5 v100.4,21.5
GAIN
  Bottom 0.508: U1.6 40.35,14.64 | 40.35,14.64 37.89,14.64 U3.3 | 40.35,14.64 40.35,8.34 40.93,7.77 43.34,7.77 43.7,8.12 C15.1 43.7,11.08 R32.1
  Bottom 0.61: R25.1 39.91,7.9 40.35,8.34
GAL_1-  (via drill 1.5 pad 2.5)
  Top 0.508: TP6.TP v53.1,48.8
  Bottom 0.508: CR3.1 55.95,47.24 54.91,46.2 C6.1 | 57.55,47.49 CR3.1 | CR3.1 55.74,48.8 v53.1,48.8 | CR3.1 57.3,49.6 57.5,49.8 R56.1
GAL_2-  (via drill 1.5 pad 2.5)
  Top 0.508: TP7.TP v96.9,48.7
  Bottom 0.508: CR1.1 94.91,47.05 95.85,46.1 C4.2 | CR1.1 92.95,47.3 | CR1.1 93.2,49.1 | v96.9,48.7 96.25,49.35 93.45,49.35 93.2,49.1 | 93.2,49.1 93,49.3 R58.1
GND  (via drill 0.35, 1.5 pad 2.5)
  Top 0.508: 63.7,39.6 63.7,42.2 62.9,43 S1.4 | C11.1 65.9,37.4 63.7,39.6 | D2.1 112.45,20 U7.GND@7 | D4.1 125.5,17.2 v126.3,18 | C1.1 77,41 79,43 S2.4 84.4,43.2 v84.4,44.2 | v65,40.5 64.1,39.6 63.7,39.6 | v52.5,15.09 52.5,12.9 v50.2,10.6
  Top 1.016: C16.1 89.9,85.7 v89.8,85.6 | 89.9,84.2 C14.1 91.4,87.1 90.9,87.6 | DZ1.2 89.8,82.2 89.4,82.6 | v96.9,87.1 v93.1,87.1 90.3,87.1 90.2,87.2
  Route2 1.54: v52.22,22.29 54.42,22.29 55.92,23.79 55.92,85.86 59.24,89.18 RCA.1
  Bottom 0.152: RSENSE.2 53.77,16.57 | 53.77,16.57 54.2,17 53.77,16.57 | RSENSE.2 53.77,16.57 | RSENSE.2 53.56,16.57 54.2,17.21
  Bottom 0.508: U1.4 48.8,13.38 49.38,12.8 49.38,10.6 | v54.2,22.3 54.2,22.4 | R10.1 49.38,10.6 | RSENSE.2 53.2,15.8 v52.5,15.1 v52.5,15.09 | v50.2,10.6 49.38,10.6
  Bottom 1.016: 92.7,87.3 U2.2 98.5,87.3 | 92.7,87.3 89.5,87.3 | 92.7,87.3 93.1,86.9
  Bottom 1.54: v52.22,22.29 52.22,17.55 RSENSE.2 54.2,17.21 54.2,22.4 | 54.2,17 55.9,18.7 v55.9,30.2
  Bottom 2.54: U2.4 81.07,87.3 80.97,87.4 | U2.4 84.82,91.83 84.9,91.91 | v89.8,87.6 89.5,87.3 87,87.3 | U2.4 84.82,83.11 84.75,83.05
  other vias: 53.2,78.6 97.2,78.6 64.55,49.5 64.55,67.44 81.6,83.5 84.6,83.5 86.1,82.6 88.7,82.5 89.9,83.6 87.4,83.5 83.2,82.5 83.1,84.4 86,84.6 88.7,84.6 87.2,85.6 84.4,85.5 81.7,85.5 81.6,87.6 83.1,86.7 85.9,86.6 88.7,86.6 87.2,87.6 84.3,87.6 81.6,89.7 83.1,88.6 85.7,88.8 88.7,88.6 89.8,89.6 87.1,89.6 84.2,89.5 81.6,91.7 83,90.7 82.8,92.7 85.5,92.7 84.1,91.8 85.6,90.7 87.1,91.7 88.5,92.7 89.8,91.7 88.7,90.7
  pour Bottom (isolate 0.254, rank 2): -3.7,-2.9 152.1,-2.9 152.1,101 -3.7,101
  pour Top: 80.4,82.6 80.4,92.6 81.1,93.3 90.9,93.3 91.8,92.4 91.8,80.8 89.5,80.8 88.6,81.7 81.3,81.7
  pour Bottom: 80.4,82.7 80.4,92.3 81.1,93 91.3,93 91.8,92.5 91.8,81.7 81.4,81.7
I_COIL  (via drill 0.35, 1.5 pad 2.5)
  Top 0.508: v53.4,60 60.52,60 v62.05,58.47 62.12,58.4 TP2.TP
  Route15 0.508: v40.8,24.3 44.6,24.3 49,28.7 50.5,28.7 56.43,34.63 56.43,56.97 v53.4,60
  Bottom 0.508: U3.6 30.12,14.66 29.36,15.43 29.36,19.65 30.71,21 C3.1 R17.2 35,21.3 36.3,22.6 36.3,23.7 36.9,24.3 v40.8,24.3
I_CURRENT  (via drill 1.5 pad 2.5)
  Bottom 0.508: R46.2 57.8,60 59.4,61.6 64.4,61.6 v64.55,61.45 TP1.TP
I_DK  (via drill 0.35, 1.5 pad 2.5)
  Top 0.508: v53.4,64.2 53.6,64.4 TP3.TP 62.02,64.4 v62.05,64.42
  Route2 0.508: v18.1,19.8 26.4,19.8 42.6,36 49.5,36 51.2,37.7 51.2,62 v53.4,64.2
  Bottom 0.508: R36.2 11.76,17.2 | U6.6 11.96,12.84 12.82,13.7 12.82,16.14 11.76,17.2 | 11.76,17.2 16.6,17.2 18.1,18.7 v18.1,19.8
I_SENSE  (via drill 0.35)
  Route2 0.508: v59.8,54.5 60.2,54.1 60.2,48.1 62.4,45.9 84.8,45.9 v96.7,34
  Route15 0.508: v96.7,34 97.2,33.5 127.69,33.5 U7.GP28_A2
  Bottom 0.508: D1.3 57.7,54.4 R46.1 v59.8,54.5
LED_DUTY  (via drill 1.5 pad 2.5)
  Top 0.508: v97.2,75.4 98,74.6 R60.1 TP4.TP
LED_HZ  (via drill 1.5 pad 2.5)
  Top 0.508: R59.1 53.1,73.5 TP5.TP v53.2,75.5
MISO  (via drill 0.35)
  Top 0.508: R24.1 30.29,27.57 32.66,25.2 v36,25.2
  Route2 0.508: v132,33.3 131.99,33.28 113.2,33.28 111.28,35.2 v111.1,35.2 | U7.GP16 94.67,22.59 91.58,19.5 41.7,19.5 v36,25.2
  Bottom 0.508: U7.GP16 94.67,29.97 99.9,35.2 v111.1,35.2 | v132,33.3 132.02,33.28 R5.1
MOSI  (via drill 0.35)
  Top 0.508: R21.1 25.19,15.8 v25.3,15.8
  Route2 0.508: U7.GP19 104.83,21.39 96.04,12.6 28.5,12.6 v25.3,15.8
  Bottom 0.508: U7.GP19 104.83,28.33 108,31.5 121.71,31.5 R3.1
N$1
  Top 0.508: R49.2 R54.2 115.7,15.6 D2.3 115.7,18.8 116.7,19.8 128.5,19.8 130.23,18.07 U7.GP4
N$2
  Bottom 0.508: Q2.1 63.16,45.59 R34.1 62.86,43.45 R33.1
N$3
  Bottom 0.508: Q1.1 88.76,45.4 R8.1 R7.1
N$4
  Bottom 0.508: U1.2 46.17,15.91 45.44,15.18 R32.2 45.44,9.06 C15.2 R10.2
N$5
  Bottom 0.61: R28.2 9.03,6.87 8,7.9 8,12.1 7.26,12.84 U6.3
N$6
  Top 0.508: R31.2 85.66,75.64 LED1.A
N$7
  Top 0.508: DISPLAY.6 R24.2
N$8
  Bottom 0.508: IC1.22 94.46,59.6 92.57,61.49 92.57,74.53 89,78.1 83.32,78.1 82.52,78.9 82.55,78.93 LED2.K
N$9
  Top 0.508: R11.2 LED2.A | LED2.A
N$10
  Bottom 0.508: IC1.23 93.96,58.33 91.34,60.95 91.34,74 88.32,77.02 77.65,77.02 76.2,78.47 LED3.K
N$11
  Top 0.508: R13.2 67.91,79.77 LED4.A
N$12
  Bottom 0.508: LED4.K 70.35,77.57 71.82,76.1 87.38,76.1 90.23,73.25 90.23,58.83 88.46,57.06 IC1.5
N$13
  Top 0.508: LED5.A 62.31,79.32 R14.2
N$14
  Bottom 0.508: LED5.K 64.3,77.07 66.47,74.9 86.77,74.9 89.28,72.39 89.28,59.58 88,58.3 86.45,58.3 IC1.6
N$15
  Top 0.508: R16.2 R15.1 S2.2
N$16
  Bottom 0.508: R41.2 R42.2 R43.2 R44.2 3.25,21.17 6.2,18.22 | R35.2 6.2,18.22 | R35.2 R36.1 | 6.2,18.22 6.39,18.41 15.36,18.41 16.85,19.9 R37.2 R38.2 R39.2 | R40.2 R39.2 | U6.2 4.22,11.57 3.76,12.03 3.76,14.45 4.82,15.51 6.21,15.51 R35.2 | JP1.1 40.33,26.5 20.95,26.5 19.75,25.3 R39.2
N$17
  Bottom 0.508: U5.6 13.47,22.8 14.97,21.3 R37.1
N$18
  Bottom 0.508: R38.1 14.58,23.3 13.81,24.06 U5.5
N$19
  Bottom 0.508: U5.4 15.02,25.34 R39.1
N$20
  Bottom 0.508: R40.1 14.6,27.3 13.9,26.6 U5.3
N$21
  Bottom 0.508: U5.14 6.39,26.6 5.6,27.4 R41.1
N$22
  Bottom 0.508: R42.1 7.07,25.3 U5.13
N$23
  Bottom 0.508: U5.12 6.43,24.06 5.67,23.3 R43.1
N$24
  Bottom 0.508: U5.11 6.34,22.8 6.21,22.66 6.21,22.56 5.05,21.4 R44.1
N$25  (via drill 0.35)
  Top 0.508: R59.2 v53.1,69.1
  Route15 0.508: v85.05,54.55 83.61,55.99 83.61,74.09 83.19,74.51 82.3,75.4 59.4,75.4 v53.1,69.1
  Bottom 0.508: IC1.3 85.12,54.52 85.1,54.5 v85.05,54.55
N$26
  Bottom 0.508: R19.1 5.07,29.4 6.59,27.88 U5.15
N$27  (via drill 0.35)
  Top 0.508: R60.2 94.5,71.8 91.1,68.4 91.1,57.1 v91,57.1
  Bottom 0.508: v91,57.1 91,56.7 90.09,55.79 IC1.4
N$28
  Top 0.508: R55.2 70.1,45.1 70.83,44.37 70.83,41 LED6.A
N$29
  Top 1.27: CR2.2 134.86,18.5 132.77,20.59 U7.3V3
N$30
  Bottom 0.508: R25.2 28.8,9.6 R26.1 26.4,11.98 25.78,12.6 C2.2
N$31
  Bottom 0.508: U4.3 26.23,7.96 R26.2 26.4,6.9 C5.2
N$34
  Bottom 0.508: U3.2 39.38,15.93 39.7,16.25 39.7,18.47 39.07,19.1 R18.1 35.1,19.1 R17.1 C3.2
N$36
  Top 0.508: U7.GP5 127.69,13.01 125.7,15 D4.3 R50.2 118.7,15 R53.2
N$37  (via drill 0.35)
  Top 0.508: LED6.K 73.47,44.3 76.47,47.3 v81.4,47.3
  Route2 0.508: v81.4,47.3 86.7,47.3 v93.9,54.5
  Bottom 0.508: v93.9,54.5 95.96,54.5 IC1.26
N$38
  Top 0.508: R48.2 60.8,37.1 R47.1 59.7,37 59.5,37.2 S1.2
N$40
  Bottom 0.508: U5.2 13.6,27.88 14,28.28 14,28.5 14.9,29.4 R23.1
N$41
  Bottom 0.508: R56.2 61.6,49.8 62.46,48.94 Q2.3
N$42
  Top 0.508: LED3.A 73.87,79.66 R12.2
N$44
  Bottom 0.508: Q1.3 88.06,48.76 88.6,49.3 R58.2
N$45
  Bottom 0.508: R45.2 96,64.7 IC1.18
N$46
  Bottom 0.508: JP1.2 40.58,29.15 R9.2 R9.3
N$59
  Bottom 0.508: IC1.21 95.16,60.87 93.61,62.42 93.61,75.45 89.05,80.01 88.34,80.01 LED1.K
PALANCA_MACHINE  (via drill 0.35, 1.5 pad 2.5)
  Route15 0.508: v62.05,70.41 62.05,69.45 58.3,65.7 58.3,24.5 61.2,21.6 v84.7,21.6
  Bottom 0.508: v84.7,21.6 88.2,21.6 97.6,12.2 102.57,12.2 107.37,7.4 U7.GP11
PALANCA_TRACK  (via drill 0.35, 1.5 pad 2.5)
  Route15 0.508: v84.9,23.7 84.85,23.75 84.85,33.25 83.5,34.6 64.3,34.6 61.09,37.81 61.09,43.42 60.2,44.31 60.2,51.9 60.79,52.49 v62.05,52.49
  Bottom 0.508: U7.GP10 109.91,7.7 101.51,16.1 96.9,16.1 89.3,23.7 v84.9,23.7
PLNC_MACHINE_+  (via drill 1.5 pad 2.5)
  Top 0.508: v64.55,73.4 R27.1
PLNC_TRACK_+  (via drill 1.5 pad 2.5)
  Top 0.508: v64.55,55.46 57.74,55.46 R57.1
PWM_GALGA_1  (via drill 0.35)
  Top 0.508: v61.6,23.3 v61.6,1.9
  Route2 0.508: v59.6,41.4 59.6,25.3 v61.6,23.3
  Bottom 0.508: U7.GP2 135.31,2.48 133.97,1.15 62.25,1.15 61.6,1.8 v61.6,1.9 | R33.2 59.74,41.26 v59.6,41.4
PWM_GALGA_2
  Bottom 0.508: R7.2 86.96,28.24 95.4,19.8 130.37,19.8 132.77,17.4 U7.GP3
RETURN
  Bottom 0.508: U1.3 49.95,14.64 53.2,11.4 RSENSE.1
  Bottom 1.016: RSENSE.1 53.2,9.13 53.6,8.73 58.13,8.73 MACHINE2.5 MACHINE2.4 MACHINE2.1 MACHINE1.4 | MACHINE1.4 MACHINE1.5 | MACHINE1.4 MACHINE1.1
RST
  Top 0.508: DISPLAY.5 27.74,32.81 R22.2
RST_2
  Bottom 0.508: R4.2 127.87,35.57 DISPLAY1.5
SAVE
  Top 0.508: C1.2 R16.1 79.4,36.2 79.8,35.8 83.7,35.8 85.01,34.49 85.01,28.49 97.21,16.29 U7.GP14
SCK  (via drill 0.35)
  Top 0.508: R20.1 22.59,16.51 25.6,13.5 v29.2,13.5
  Route2 0.508: v29.2,13.5 29.3,13.4 94.4,13.4 102.29,21.29 U7.GP18
  Bottom 0.508: U7.GP18 102.29,28.99 106.75,33.45 R2.1
SCL  (via drill 0.35)
  Top 0.508: J1.3 118.58,13.08 R53.1
  Route15 0.508: 87.45,15.12 84.38,18.2 12.6,18.2 v2,28.8 | 87.45,15.12 95.16,7.42 117.1,7.42 J1.3 | v87.9,65.9 87.45,65.45 87.45,15.12
  Bottom 0.508: v2,28.8 2.6,29.4 R19.2 | v87.9,65.9 87.85,65.95 IC1.12
SDA  (via drill 0.35)
  Top 0.508: J1.2 116.04,13.34 R54.1
  Route15 0.508: J1.2 111.54,13.4 96,13.4 88.8,20.6 88.8,66.5 88.1,67.2 v84.9,67.2 86.4,65.7 86.4,21.6 84,19.2 31.1,19.2 v18.7,31.6
  Bottom 0.508: v84.9,67.2 84.92,67.22 IC1.13 | v18.7,31.6 18.7,30.3 17.8,29.4 R23.2
SS1  (via drill 0.35, 0.5)
  Route2 0.508: v103,31.9 137.4,31.9 v138.7,33.2 | U7.GP17 97.21,22.99 92.32,18.1 41.7,18.1 v37.2,22.6
  Bottom 0.508: U7.GP17 97.21,28.41 100.7,31.9 v103,31.9 | R6.1 137.56,33.2 v138.7,33.2
SS2  (via drill 0.5)
  Top 0.508: R29.1 v37.12,27.82
  Route2 0.508: v37.12,27.82 37.12,25.88 42.5,20.5 89.1,20.5 91.8,23.2 91.8,27.2 93.4,28.8 108.3,28.8 109.91,27.19 U7.GP21
TRACK
  Top 0.508: R48.1 65.8,35.3 C11.2 66.9,34.2 83.4,34.2 83.95,33.66 83.95,28.05 94.67,17.33 U7.GP15
V+_1  (via drill 1.5 pad 2.5)
  Top 1.016: v64.5,32 60.8,32 56.43,27.63 56.43,18.72 MACHINE2.6
V+_2  (via drill 1.5 pad 2.5)
  Top 1.016: v64.5,24 64.5,21.32 66.2,19.62 74.01,19.62 77.58,16.05 MACHINE1.6
VIN+  (via drill 0.35, 1.5 pad 2.5)
  Top 1.016: v58.6,80.9 58.6,83.6 60.48,85.48 RCA.2 RCA.3
  Route2 0.813: 94.2,91.6 v94,91.6
  Route2 1.016: v58.6,80.9 58.6,46.7 60.5,44.8 v66.3,44.8 62.3,44.8 61.2,43.7 61.2,29.1 62.3,28 v64.5,28 | v94,91.6 96,89.6 96,89.1
  Route2 1.27: RCA.3 78.55,85.58 78.55,92.75 80.5,94.7 91.3,94.7 92.9,93.1 v92.9,92.8 | v92.9,92.8 94.1,91.6 v94.1,91.1 94.2,91.2 | 94.2,91.2 94.2,91.6 v94.9,90.9 94.9,88.9 v95.3,88.5 v96.6,88.5 96,89.1 | 94.2,91.2 v94.2,88.5 | v92.9,92.8 93,92.7 v93,88.5
  Bottom 0.508: R52.1 68.3,46.8 v66.3,44.8
  other vias: 59.5,82.4 57.7,82 59.8,79.4 57.5,79.4 58.6,78.7
  pour Top (isolate 0.254): 56.9,82.9 56.9,78.2 60.3,78.2 60.3,83 56.9,83
  pour Route2 (isolate 0.254): 56.6,83.2 56.6,78 60.5,78 60.5,83.2
  pour Top: 92.5,93 92.6,93.1 93,93.1 97.3,88.8 97.3,88.4 96.9,88 92.5,88
  pour Bottom: 92.4,94.9 92.6,95.1 99.5,95.1 99.5,88.9 98.6,88 92.4,88
VIN_SENSE  (via drill 0.35)
  Route2 0.508: U7.GP27_A1 115.4,30.6 89.9,30.6 80.9,39.6 v80.9,40.79
  Bottom 0.508: R52.2 D3.3 R51.1 77,46.9 C17.2 79.9,46.9 80.9,45.9 v80.9,40.79

### Text on the board
tPlace: GND | GND | LED | + | LED | PLNC_MCHN | - | I_DK | I_C | I_COIL | D | + | - | - | - | + | + | GND | GND | GND | 3v3
bPlace: SenseCalib / v2-Ene'25